# EAGLE design preparedinstruments_0_bechemel_v12_KEYPAD_no_values (EAGLE 9.6.2)

## Sheet 1 of 2
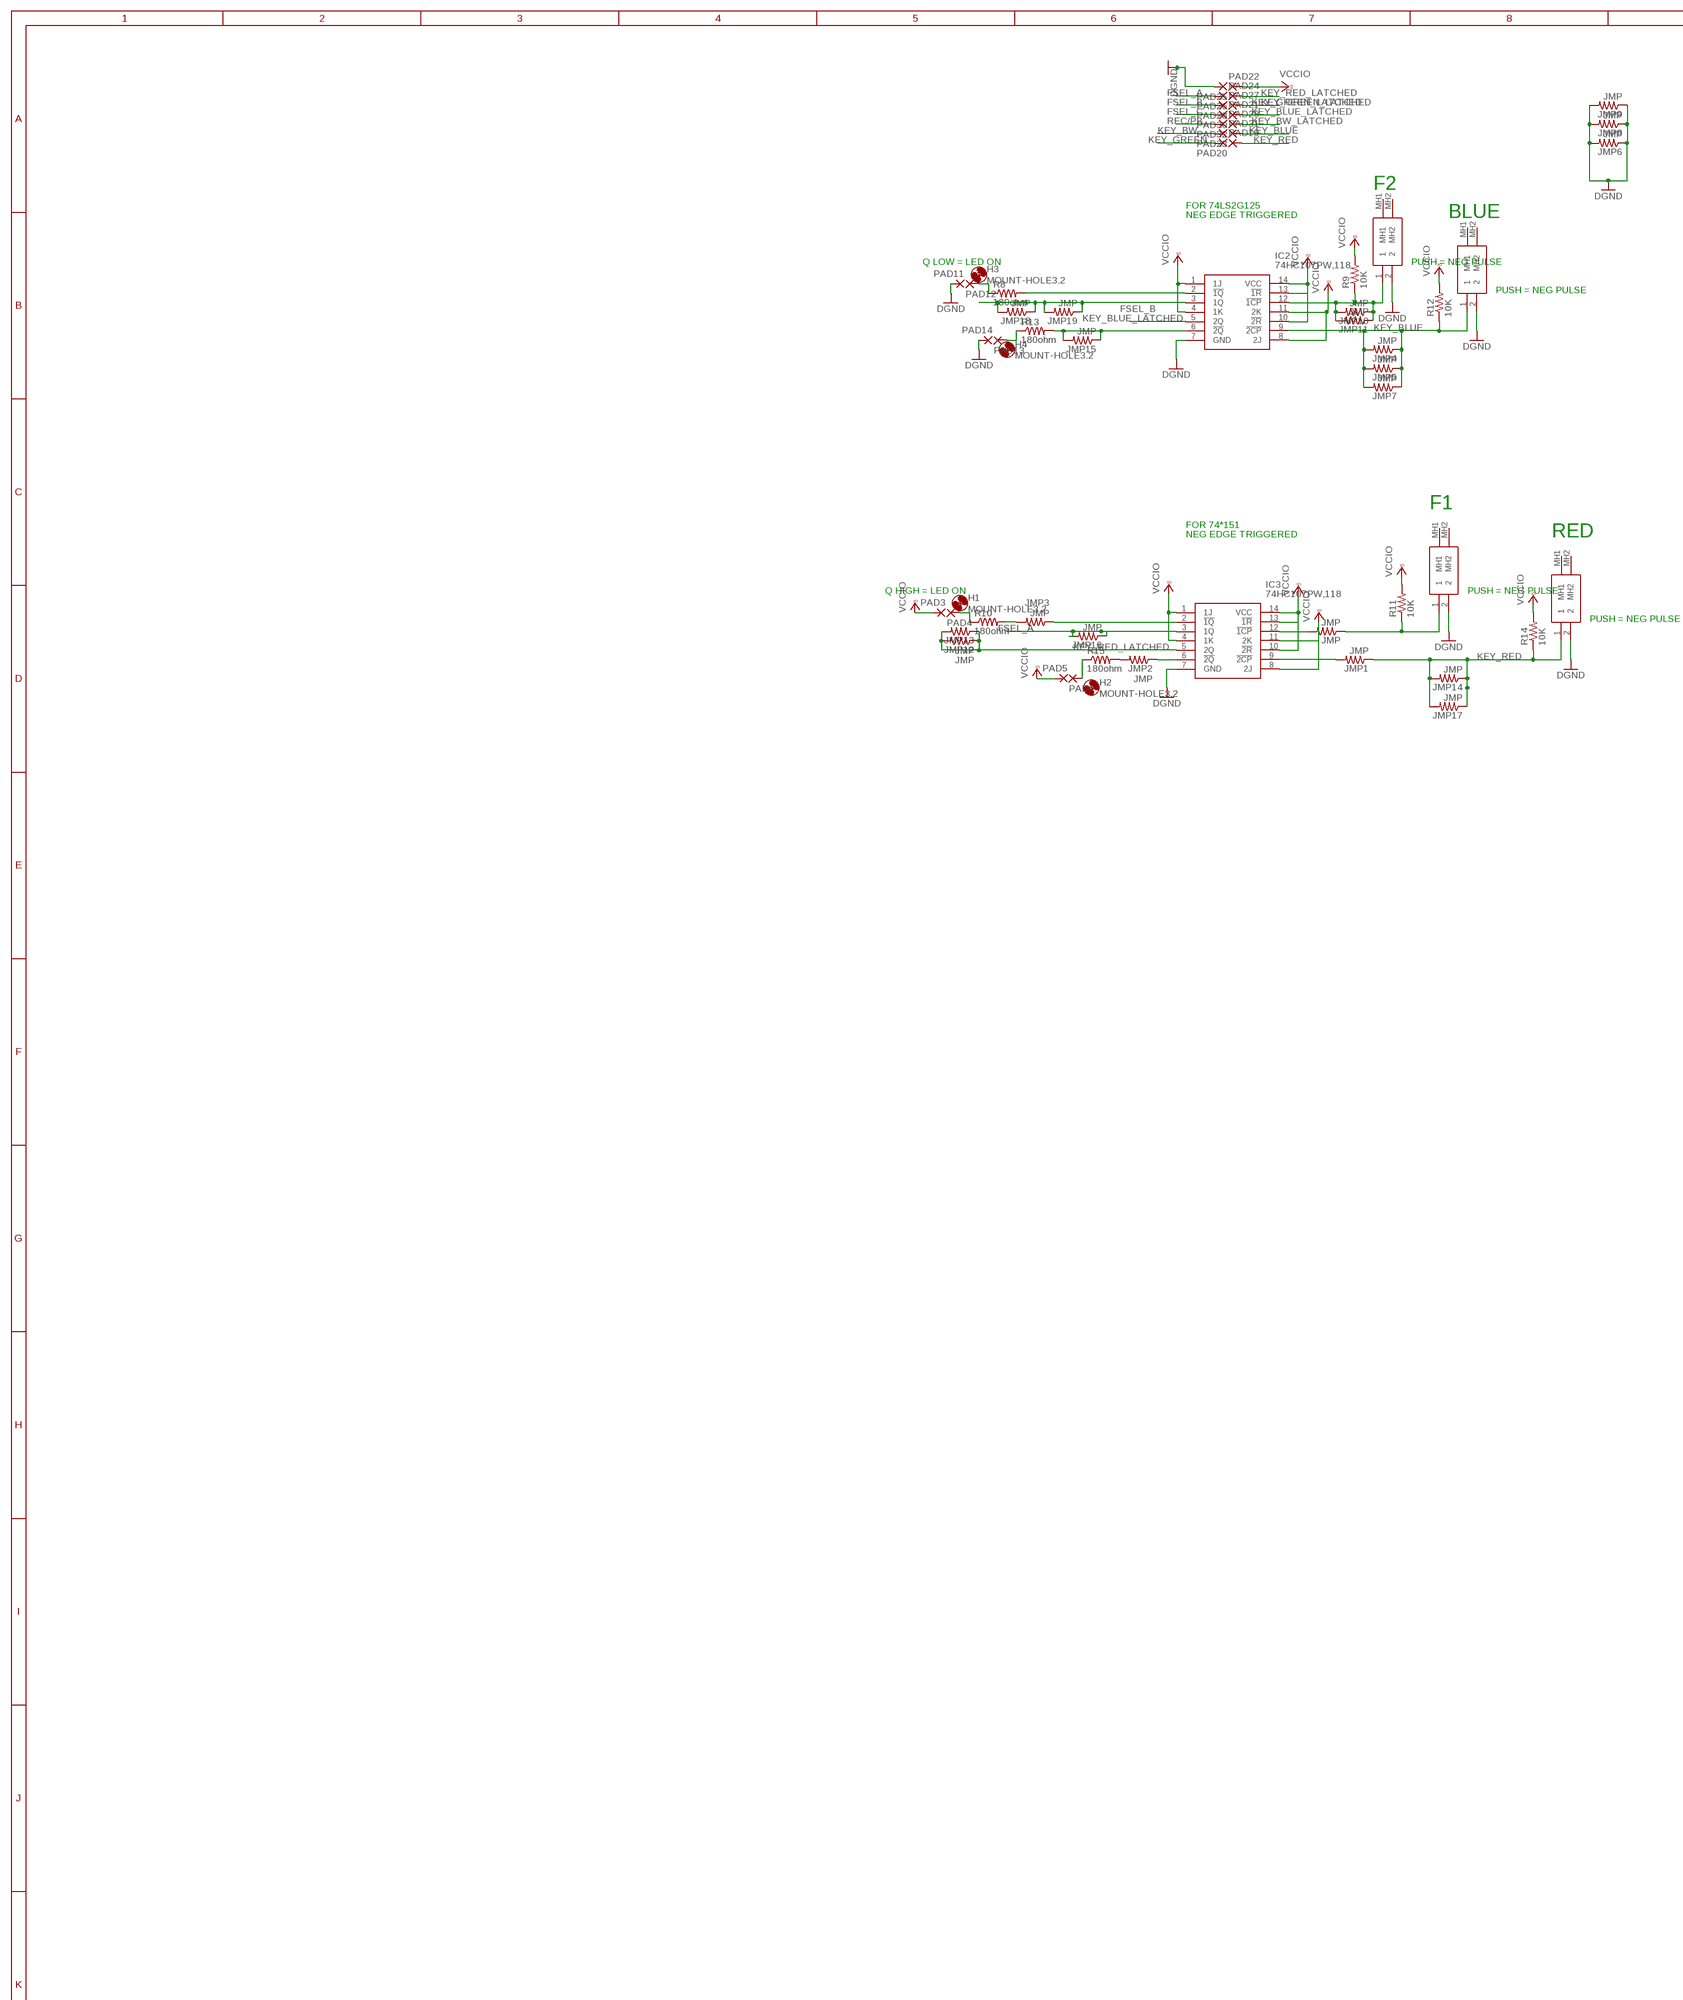
[diagram p0: schematic, sheet 1, part 1 of 3]
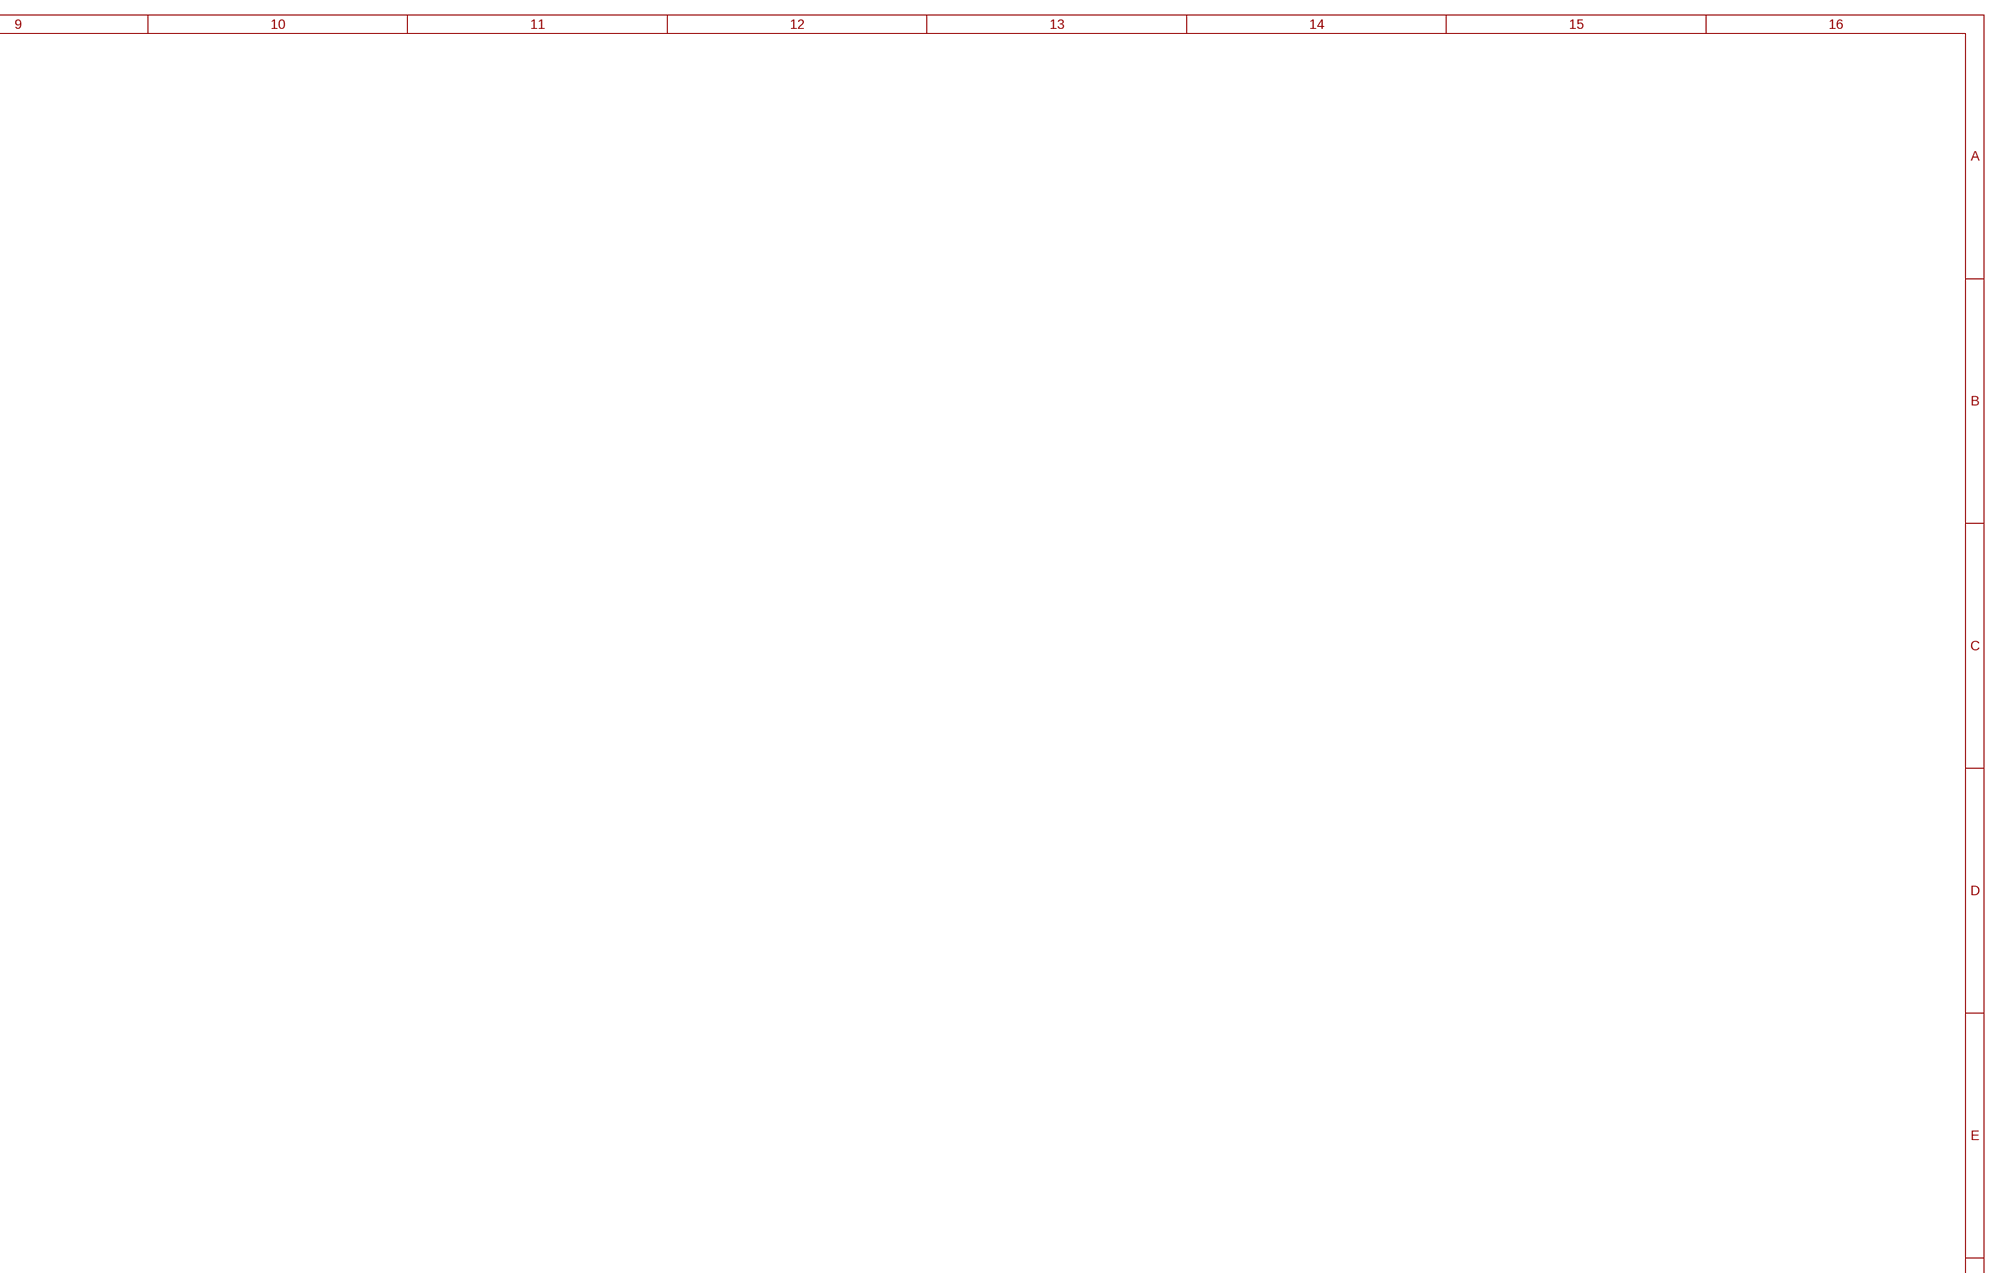
[diagram p1: schematic, sheet 1, part 2 of 3]
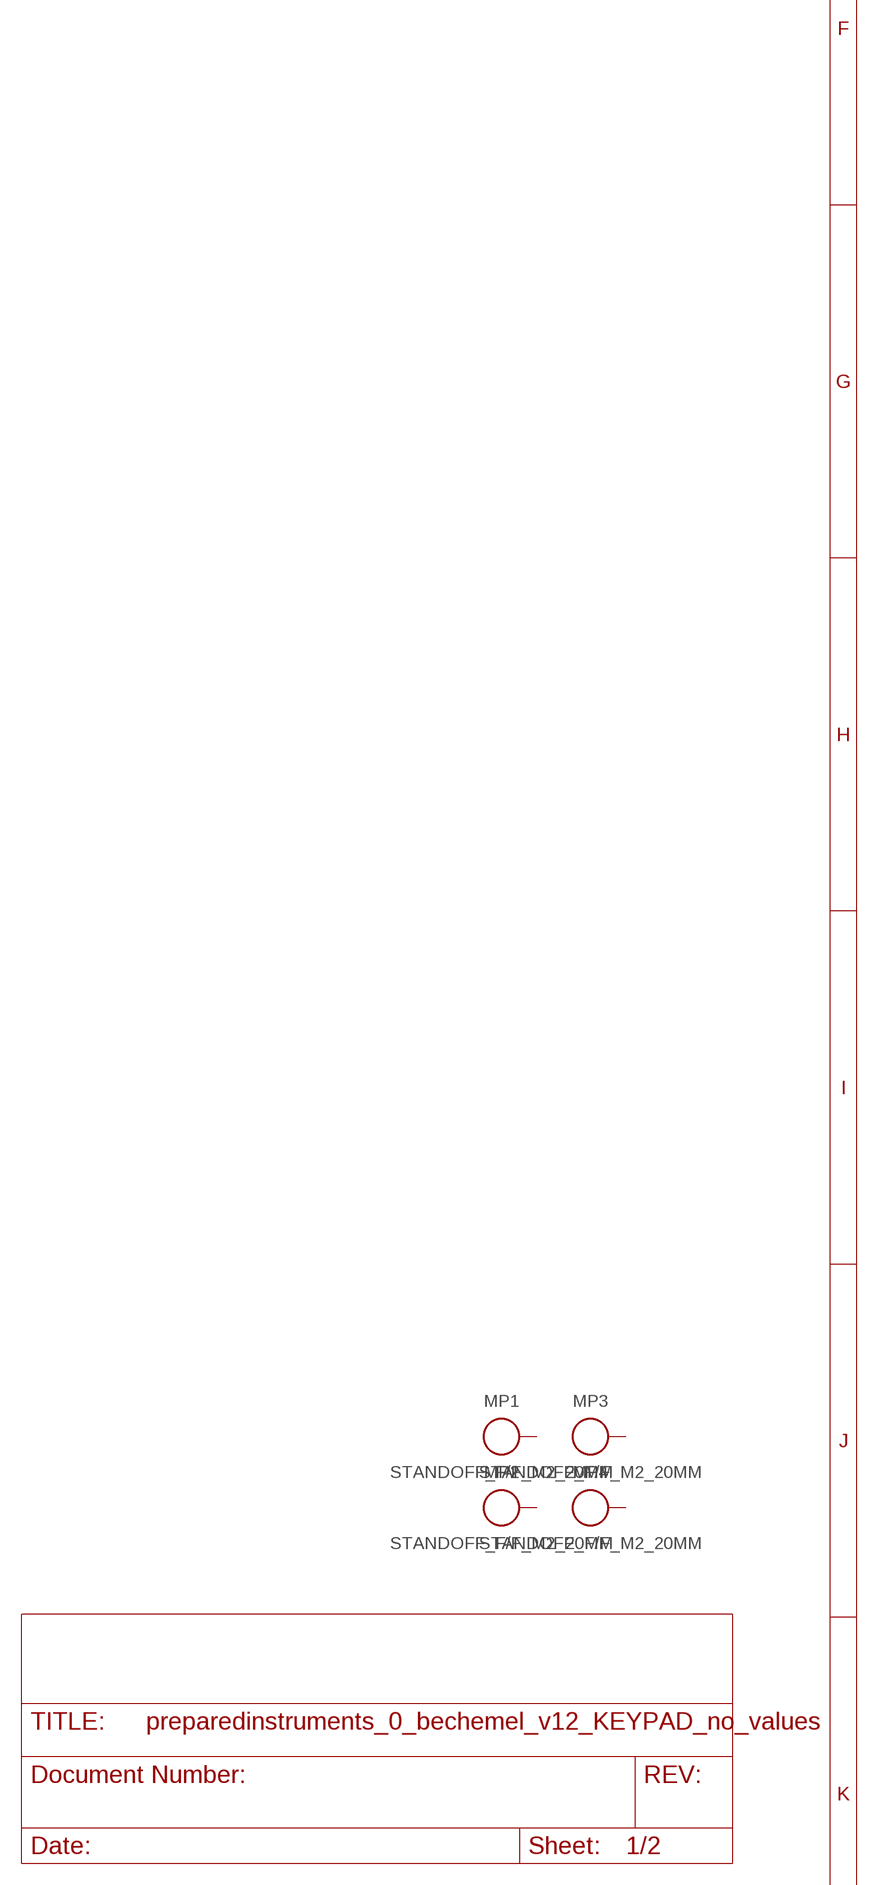
[diagram p2: schematic, sheet 1, part 3 of 3]

### Parts
H1  MOUNT-HOLE3.2  [3,2]
H2  MOUNT-HOLE3.2  [3,2]
H3  MOUNT-HOLE3.2  [3,2]
H4  MOUNT-HOLE3.2  [3,2]
IC2  74HC107PW,118  [SOP65P640X110-14N]
IC3  74HC107PW,118  [SOP65P640X110-14N]
JMP  JMP  R-US_R0805  [R0805]
JMP1  JMP  R-US_R0805  [R0805]
JMP2  JMP  R-US_R0805  [R0805]
JMP3  JMP  R-US_R0805  [R0805]
JMP4  JMP  R-US_R0805  [R0805]
JMP5  JMP  R-US_R0805  [R0805]
JMP6  JMP  R-US_R0805  [R0805]
JMP7  JMP  R-US_R0805  [R0805]
JMP8  JMP  R-US_R0805  [R0805]
JMP9  JMP  R-US_R0805  [R0805]
JMP10  JMP  R-US_R0805  [R0805]
JMP11  JMP  R-US_R0805  [R0805]
JMP12  JMP  R-US_R0805  [R0805]
JMP13  JMP  R-US_R0805  [R0805]
JMP14  JMP  R-US_R0805  [R0805]
JMP15  JMP  R-US_R0805  [R0805]
JMP16  JMP  R-US_R0805  [R0805]
JMP17  JMP  R-US_R0805  [R0805]
JMP18  JMP  R-US_R0805  [R0805]
JMP19  JMP  R-US_R0805  [R0805]
MP1  STANDOFF_F/F_M2_20MM  [STANDOFF_HEX_FEMALE_400X2000_M2X0.4_MTGP600H220]
MP2  STANDOFF_F/F_M2_20MM  [STANDOFF_HEX_FEMALE_400X2000_M2X0.4_MTGP600H220]
MP3  STANDOFF_F/F_M2_20MM  [STANDOFF_HEX_FEMALE_400X2000_M2X0.4_MTGP600H220]
MP4  STANDOFF_F/F_M2_20MM  [STANDOFF_HEX_FEMALE_400X2000_M2X0.4_MTGP600H220]
PAD3  SMD2  [SMD1,27-2,54]
PAD4  SMD2  [SMD1,27-2,54]
PAD5  SMD2  [SMD1,27-2,54]
PAD6  SMD2  [SMD1,27-2,54]
PAD11  SMD2  [SMD1,27-2,54]
PAD12  SMD2  [SMD1,27-2,54]
PAD13  SMD2  [SMD1,27-2,54]
PAD14  SMD2  [SMD1,27-2,54]
PAD19  SMD2  [SMD1,27-2,54]
PAD20  SMD2  [SMD1,27-2,54]
PAD21  SMD2  [SMD1,27-2,54]
PAD22  SMD2  [SMD1,27-2,54]
PAD23  SMD2  [SMD1,27-2,54]
PAD24  SMD2  [SMD1,27-2,54]
PAD25  SMD2  [SMD1,27-2,54]
PAD26  SMD2  [SMD1,27-2,54]
PAD27  SMD2  [SMD1,27-2,54]
PAD28  SMD2  [SMD1,27-2,54]
PAD29  SMD2  [SMD1,27-2,54]
PAD30  SMD2  [SMD1,27-2,54]
PAD31  SMD2  [SMD1,27-2,54]
PAD32  SMD2  [SMD1,27-2,54]
R8  180ohm  R-US_R0805  [R0805]
R9  10K  R-US_R0805  [R0805]
R10  180ohm  R-US_R0805  [R0805]
R11  10K  R-US_R0805  [R0805]
R12  10K  R-US_R0805  [R0805]
R13  180ohm  R-US_R0805  [R0805]
R14  10K  R-US_R0805  [R0805]
R15  180ohm  R-US_R0805  [R0805]
S6  MX1A-11NW  [MX1A11NW]
S7  MX1A-11NW  [MX1A11NW]
S8  MX1A-11NW  [MX1A11NW]
S9  MX1A-11NW  [MX1A11NW]

### Nets
DGND: IC2.7(GND) IC3.7(GND) JMP6.1 JMP6.2 JMP8.1 JMP8.2 JMP9.1 JMP9.2 PAD11.1(P) PAD14.1(P) PAD25.1(P) S6.2 S7.2 S8.2 S9.2 ; also sheet 2
FSEL_A: IC3.3(1Q) JMP16.1 JMP16.2 PAD26.1(P)
FSEL_B: IC2.3(1Q) JMP18.1 JMP18.2 JMP19.1 JMP19.2 PAD28.1(P)
FSEL_C: PAD30.1(P) ; also sheet 2
KEY_BLUE: IC2.9(!2CP) JMP4.1 JMP4.2 JMP5.1 JMP5.2 JMP7.1 JMP7.2 PAD31.1(P) R12.1 S8.1
KEY_BLUE_LATCHED: IC2.5(2Q) PAD21.1(P)
KEY_BW: PAD23.1(P) ; also sheet 2
KEY_BW_LATCHED: PAD29.1(P) ; also sheet 2
KEY_GREEN: PAD20.1(P) ; also sheet 2
KEY_GREEN_LATCHED: PAD27.1(P) ; also sheet 2
KEY_RED: JMP1.1 JMP14.1 JMP14.2 JMP17.1 JMP17.2 PAD19.1(P) R14.1 S9.1
KEY_RED_LATCHED: IC3.5(2Q) JMP12.1 JMP12.2 JMP13.1 JMP13.2 PAD24.1(P)
N$13: PAD12.1(P) R8.1
N$14: IC2.2(!1Q) R8.2
N$16: IC2.12(!1CP) JMP10.1 JMP10.2 JMP11.1 JMP11.2 R9.1 S6.1
N$17: PAD4.1(P) R10.1
N$18: JMP3.2 R10.2
N$20: IC3.12(!1CP) JMP.2
N$22: PAD13.1(P) R13.1
N$23: IC2.6(!2Q) JMP15.1 JMP15.2 R13.2
N$26: PAD6.1(P) R15.1
N$27: JMP2.2 R15.2
N$33: JMP.1 R11.1 S7.1
N$35: IC3.9(!2CP) JMP1.2
N$36: IC3.6(!2Q) JMP2.1
N$37: IC3.2(!1Q) JMP3.1
REC/PB: PAD32.1(P) ; also sheet 2
VCCIO: IC2.1(1J) IC2.4(1K) IC2.8(2J) IC2.10(!2R) IC2.11(2K) IC2.13(!1R) IC2.14(VCC) IC3.1(1J) IC3.4(1K) IC3.8(2J) IC3.10(!2R) IC3.11(2K) IC3.13(!1R) IC3.14(VCC) PAD3.1(P) PAD5.1(P) PAD22.1(P) R9.2 R11.2 R12.2 R14.2 ; also sheet 2
Unconnected: MP1.1 MP2.1 MP3.1 MP4.1 S6.MH1 S6.MH2 S7.MH1 S7.MH2 S8.MH1 S8.MH2 S9.MH1 S9.MH2

### Notes on the sheet
- F2
- FOR 74LS2G125
- NEG EDGE TRIGGERED | BLUE
- Q LOW = LED ON | PUSH = NEG PULSE
- PUSH = NEG PULSE
- F1
- FOR 74*151
- NEG EDGE TRIGGERED | RED
- Q HIGH = LED ON | PUSH = NEG PULSE
- PUSH = NEG PULSE

## Sheet 2 of 2
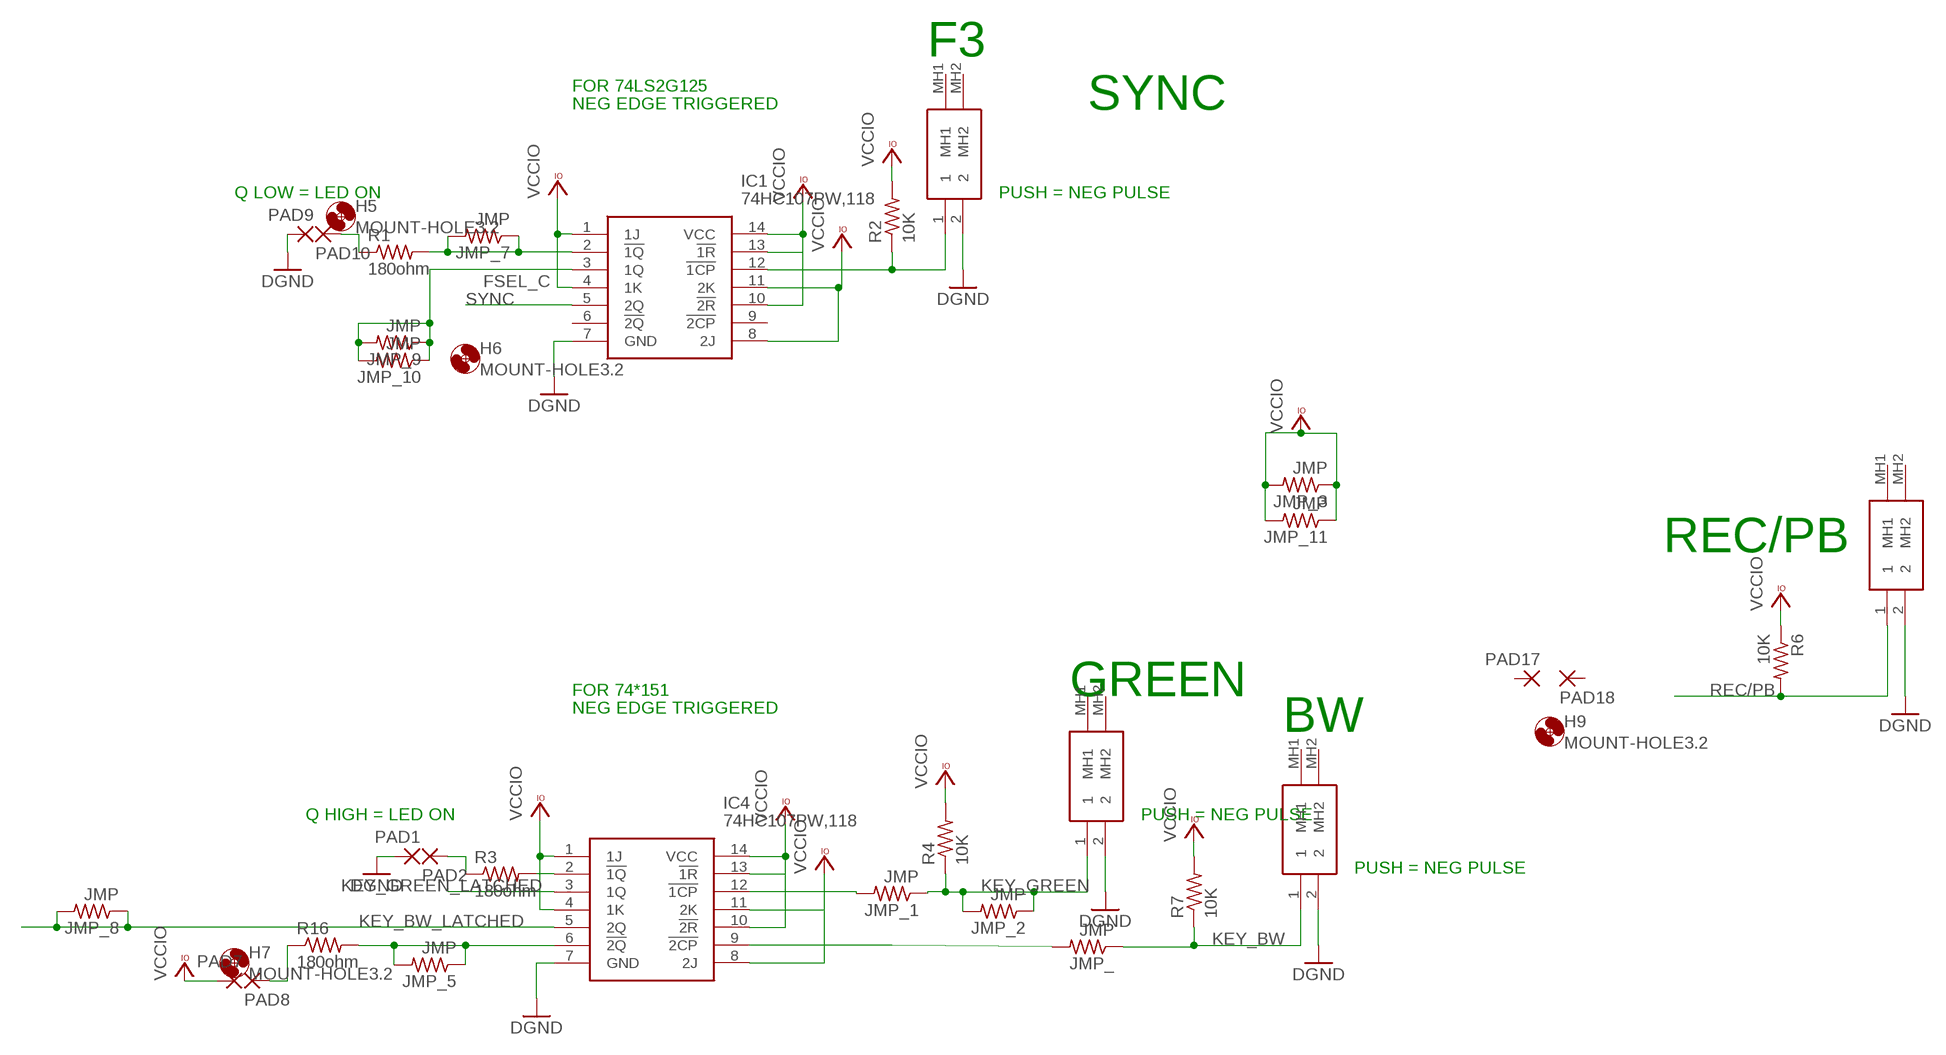
[diagram p3: schematic, sheet 2]

### Parts
H5  MOUNT-HOLE3.2  [3,2]
H6  MOUNT-HOLE3.2  [3,2]
H7  MOUNT-HOLE3.2  [3,2]
H9  MOUNT-HOLE3.2  [3,2]
IC1  74HC107PW,118  [SOP65P640X110-14N]
IC4  74HC107PW,118  [SOP65P640X110-14N]
JMP_  JMP  R-US_R0805  [R0805]
JMP_1  JMP  R-US_R0805  [R0805]
JMP_2  JMP  R-US_R0805  [R0805]
JMP_3  JMP  R-US_R0805  [R0805]
JMP_5  JMP  R-US_R0805  [R0805]
JMP_7  JMP  R-US_R0805  [R0805]
JMP_8  JMP  R-US_R0805  [R0805]
JMP_9  JMP  R-US_R0805  [R0805]
JMP_10  JMP  R-US_R0805  [R0805]
JMP_11  JMP  R-US_R0805  [R0805]
PAD1  SMD2  [SMD1,27-2,54]
PAD2  SMD2  [SMD1,27-2,54]
PAD7  SMD2  [SMD1,27-2,54]
PAD8  SMD2  [SMD1,27-2,54]
PAD9  SMD2  [SMD1,27-2,54]
PAD10  SMD2  [SMD1,27-2,54]
PAD17  SMD2  [SMD1,27-2,54]
PAD18  SMD2  [SMD1,27-2,54]
R1  180ohm  R-US_R0805  [R0805]
R2  10K  R-US_R0805  [R0805]
R3  180ohm  R-US_R0805  [R0805]
R4  10K  R-US_R0805  [R0805]
R6  10K  R-US_R0805  [R0805]
R7  10K  R-US_R0805  [R0805]
R16  180ohm  R-US_R0805  [R0805]
S1  MX1A-11NW  [MX1A11NW]
S2  MX1A-11NW  [MX1A11NW]
S4  MX1A-11NW  [MX1A11NW]
S5  MX1A-11NW  [MX1A11NW]

### Nets
DGND: IC1.7(GND) IC4.7(GND) PAD1.1(P) PAD9.1(P) S1.2 S2.2 S4.2 S5.2 ; also sheet 1
FSEL_C: IC1.3(1Q) JMP_9.1 JMP_9.2 JMP_10.1 JMP_10.2 ; also sheet 1
KEY_BW: JMP_.1 R7.1 S4.1 ; also sheet 1
KEY_BW_LATCHED: IC4.5(2Q) JMP_8.1 JMP_8.2 ; also sheet 1
KEY_GREEN: JMP_1.1 JMP_2.1 JMP_2.2 R4.1 S2.1 ; also sheet 1
KEY_GREEN_LATCHED: IC4.3(1Q) ; also sheet 1
N$1: PAD10.1(P) R1.1
N$2: IC1.2(!1Q) JMP_7.1 JMP_7.2 R1.2
N$4: IC1.12(!1CP) R2.1 S1.1
N$5: PAD2.1(P) R3.1
N$6: IC4.2(!1Q) R3.2
N$30: PAD8.1(P) R16.1
N$31: IC4.6(!2Q) JMP_5.1 JMP_5.2 R16.2
N$34: IC4.9(!2CP) JMP_.2
N$39: IC4.12(!1CP) JMP_1.2
REC/PB: R6.2 S5.1 ; also sheet 1
SYNC: IC1.5(2Q)
VCCIO: IC1.1(1J) IC1.4(1K) IC1.8(2J) IC1.10(!2R) IC1.11(2K) IC1.13(!1R) IC1.14(VCC) IC4.1(1J) IC4.4(1K) IC4.8(2J) IC4.10(!2R) IC4.11(2K) IC4.13(!1R) IC4.14(VCC) JMP_3.1 JMP_3.2 JMP_11.1 JMP_11.2 PAD7.1(P) R2.2 R4.2 R6.1 R7.2 ; also sheet 1
Unconnected: IC1.6(!2Q) IC1.9(!2CP) PAD17.1(P) PAD18.1(P) S1.MH1 S1.MH2 S2.MH1 S2.MH2 S4.MH1 S4.MH2 S5.MH1 S5.MH2

### Notes on the sheet
- F3
- FOR 74LS2G125
- NEG EDGE TRIGGERED | SYNC
- Q LOW = LED ON | PUSH = NEG PULSE
- REC/PB
- FOR 74*151 | GREEN
- NEG EDGE TRIGGERED
- BW
- Q HIGH = LED ON | PUSH = NEG PULSE
- PUSH = NEG PULSE

## Library data of the parts
H1-H7 H9 = holes:MOUNT-HOLE: MOUNTING HOLE with drill center marker
IC1-IC4 = 74HC107PW_118:74HC107PW,118: 74HC(T)107 - Dual JK flip-flop with reset; negative-edge trigger@en-us Source: Datasheet <https://assets.nexperia.com/documents/data-sheet/74HC_HCT107.pdf>; DESCRIPTION: 74HC(T)107 - Dual JK flip-flop with reset; negative-edge trigger@en-us; HEIGHT: 1.1mm; MANUFACTURER_NAME: Nexperia; MANUFACTURER_PART_NUMBER: 74HC107PW,118; MOUSER_PART_NUMBER: 771-HC107PW118; MOUSER_PRICE-STOCK: https://www.mouser.co.uk/ProductDetail/Nexperia/74HC107PW118?qs=P62ublwmbi8k2l1WkAc68Q%3D%3D
JMP JMP1-JMP19 JMP_ JMP_1-JMP_3 JMP_5 JMP_7-JMP_11 R1-R4 R6-R16 = adafruit:R-US_: RESISTOR, American symbol
MP1-MP4 = PCB-Fasteners_Hardware:STANDOFF_F/F: Female-Female Standoff/Spacer with Mounting pad and hole. Essentra : Female Standoff <https://www.essentracomponents.co.in/index.php?option=com_virtuemart&view=productdetails&virtuemart_product_id=14493> The hole and pad sizes may vary based on the application and type of hardware; always verify the Manufacturer specification or Global Standards.; CATEGORY: Standoff/Spacer; SUB-CATEGORY: Female-Female
PAD1-PAD14 PAD17-PAD32 = wirepad:SMD2: SMD PAD
S1 S2 S4-S9 = MX1A-11NW:MX1A-11NW: CHERRY - MX1A-11NW - Tactile Switch, MX Series, Top Actuated, Surface Mount, Plunger for Cap, 59.5 gf, 10mA at 12VDC Source: Datasheet <https://media.digikey.com/pdf/Data Sheets/Cherry PDFs/MX Series.pdf>; DESCRIPTION: CHERRY - MX1A-11NW - Tactile Switch, MX Series, Top Actuated, Surface Mount, Plunger for Cap, 59.5 gf, 10mA at 12VDC; HEIGHT: 15.2mm; MANUFACTURER_NAME: Cherry; MANUFACTURER_PART_NUMBER: MX1A-11NW; MOUSER_PART_NUMBER: 540-MX1A-11NW; MOUSER_PRICE-STOCK: https://www.mouser.co.uk/ProductDetail/CHERRY/MX1A-11NW?qs=5iusCjFLgR7487Rvpe7dvw%3D%3D

## Board
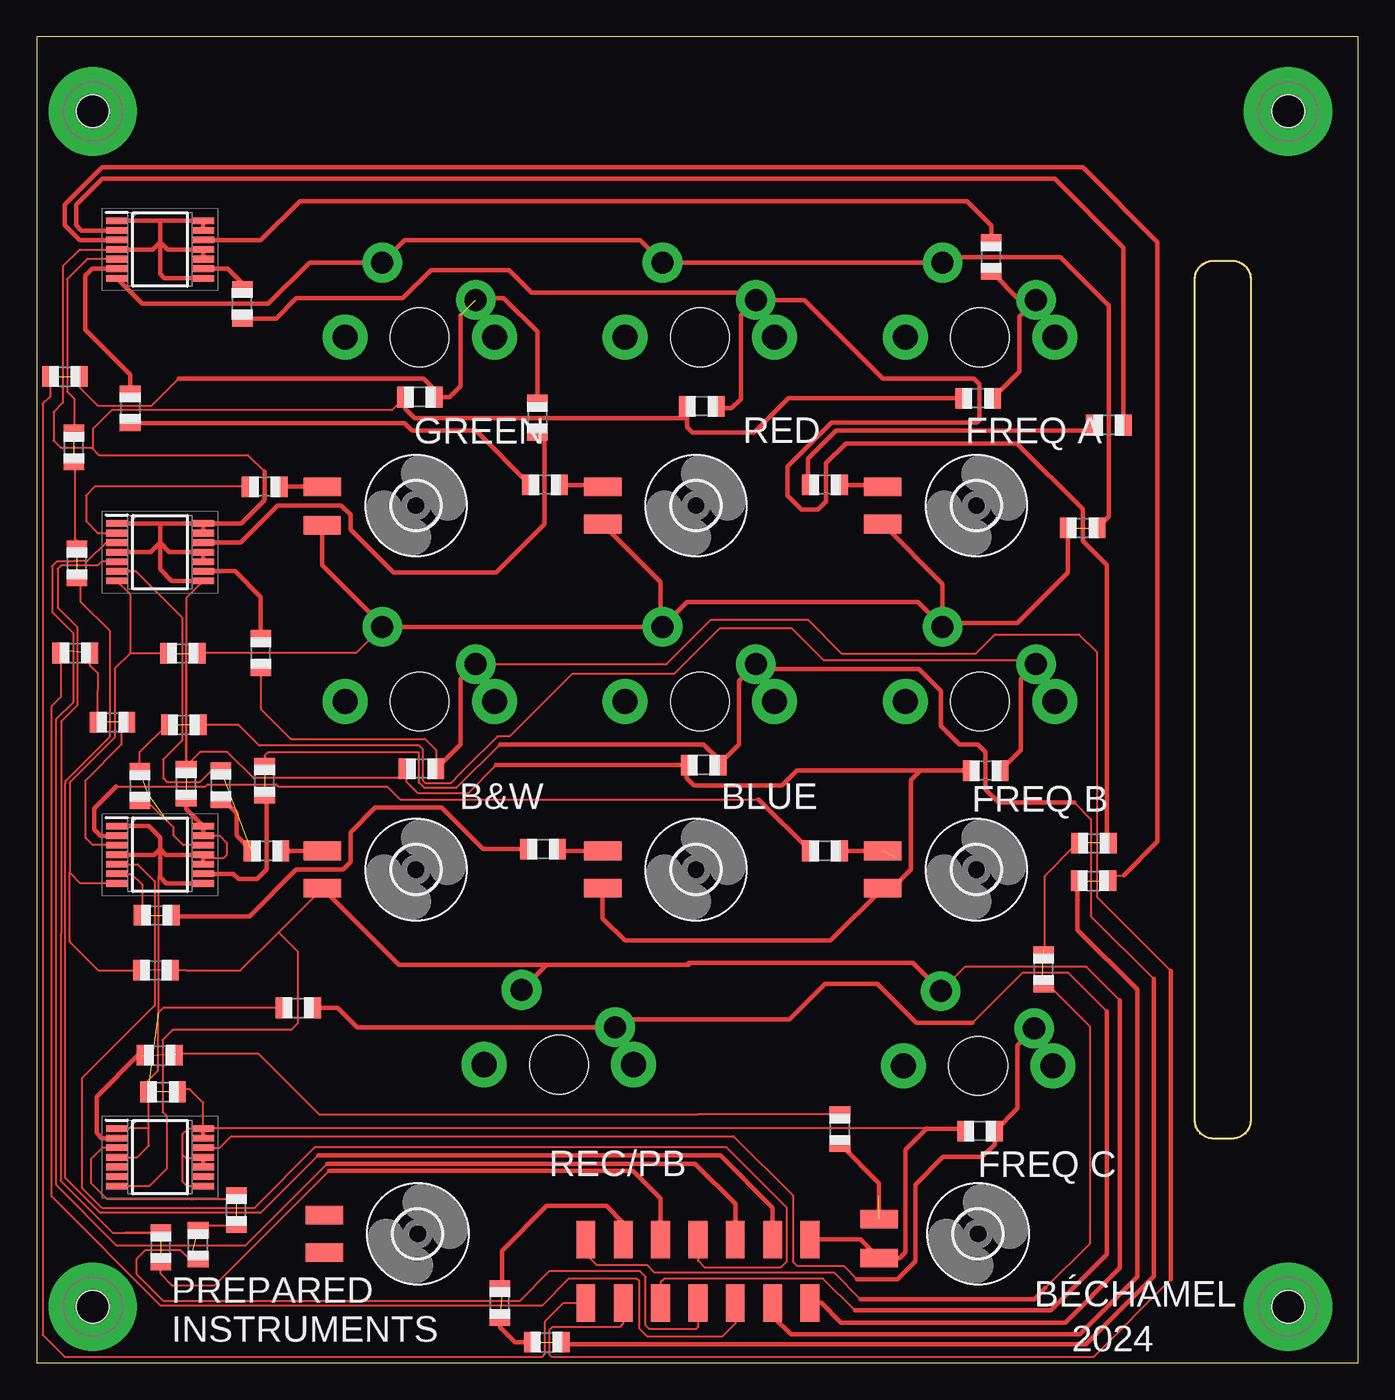
[diagram p4: board, top side]
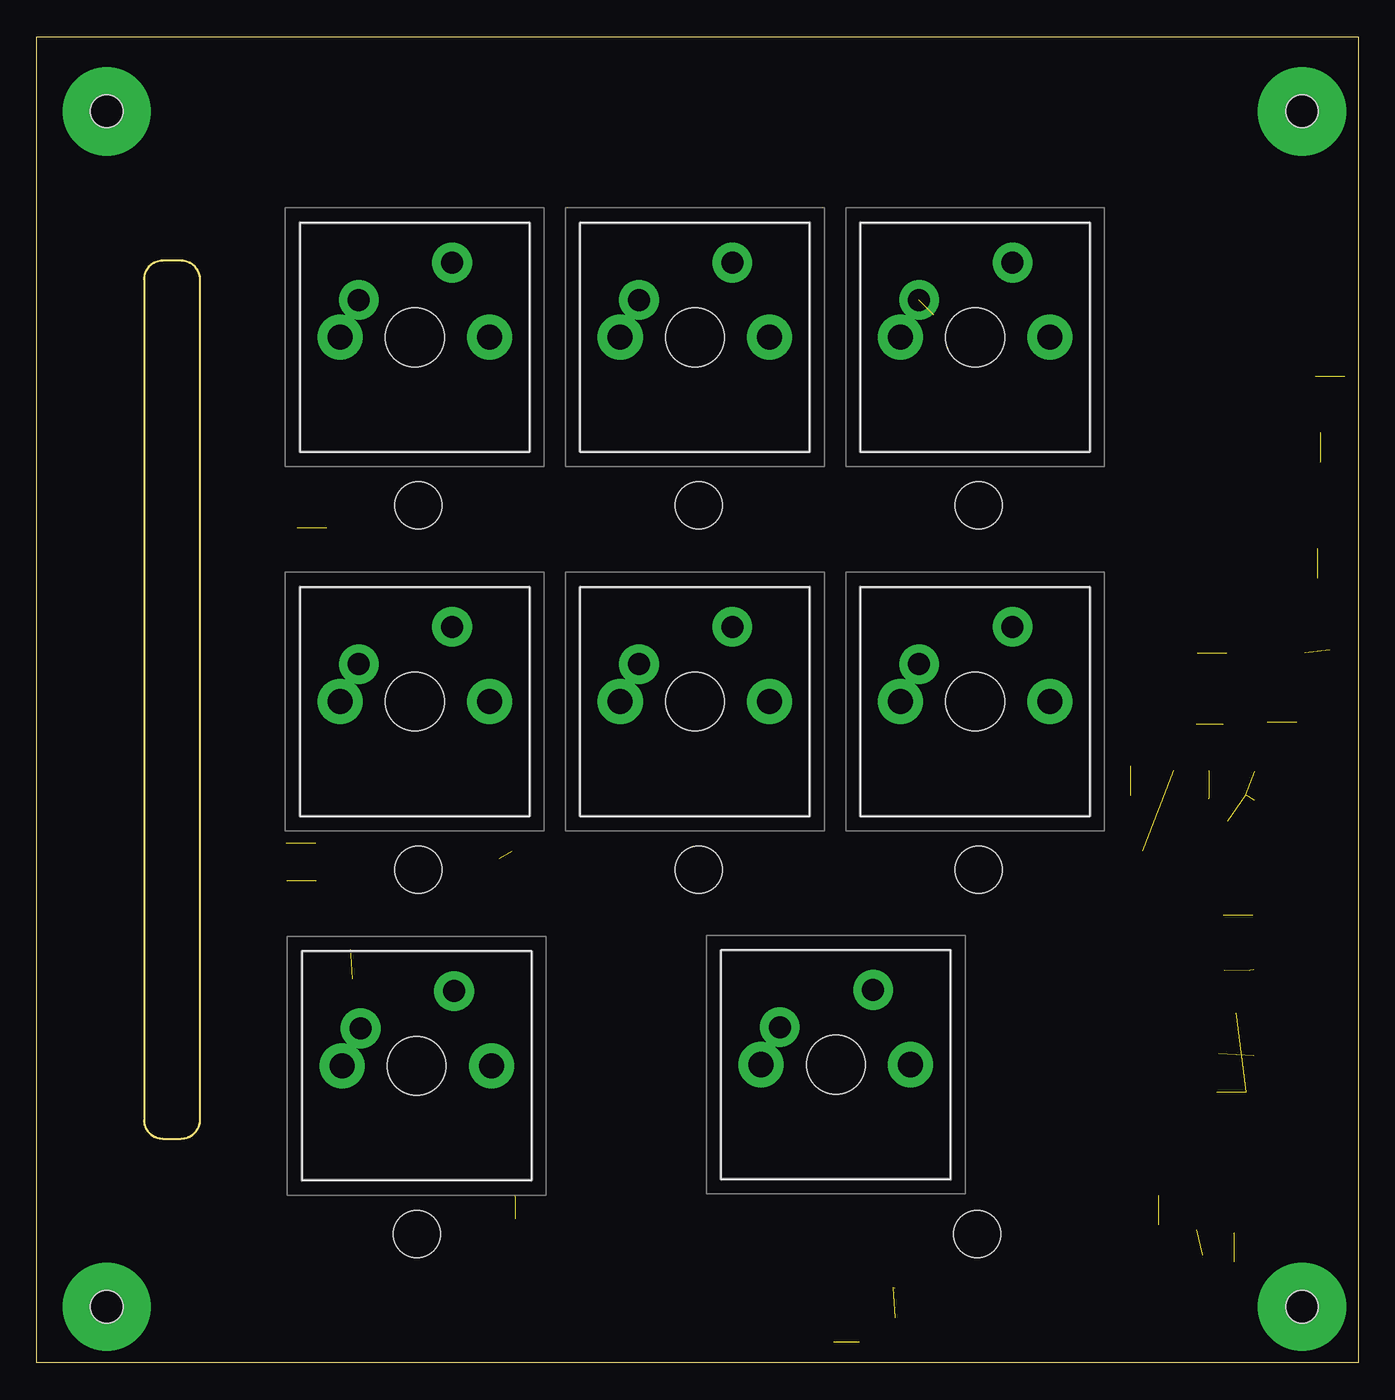
[diagram p5: board, bottom side, seen from below]

Size 89.84 x 90.16 mm. Coordinates in mm from the lower left corner, seen from the top.
Outline: 0,0 89.84,0 89.84,90.16 0,90.16 0,0
Outline: 82.55,73.66 82.55,16.51 arc-90 81.28,15.24 80.01,15.24 arc-90 78.74,16.51 78.74,73.66 arc-90 80.01,74.93 81.28,74.93 arc-90 82.55,73.66
Copper layers (1*16): Top 0.035mm / dielectric 1.6mm / Bottom 0.035mm
Design rules "jlcpcb-2layers": minimum track width 5mil, minimum drill 0.3mm, track to track 5mil, track to pad 5mil, pad to pad 5mil, via to via 5mil, smd to smd 5mil, copper to edge 0.2mm, drill to drill 6mil, minimum pad ring 10mil, minimum via ring 3mil, stop-mask expansion 4mil, vias tented up to drill 0mil, thermal gap 10mil

### Footprints (pad centres in the part's own frame; a part is rotated, then mirrored left to right if it is on the bottom)
3,2 = hole 3.2: 0,0
SOP65P640X110-14N = smd 1.475 x 0.45: 1 -2.938,1.95; 2 -2.938,1.3; 3 -2.938,0.65; 4 -2.938,0; 5 -2.938,-0.65; 6 -2.938,-1.3; 7 -2.938,-1.95; 8 2.938,-1.95; 9 2.938,-1.3; 10 2.938,-0.65; 11 2.938,0; 12 2.938,0.65; 13 2.938,1.3; 14 2.938,1.95
R0805 = smd 1.1 x 1.4: 1 -1,0; 2 1,0
STANDOFF_HEX_FEMALE_400X2000_M2X0.4_MTGP600H220 = drill 2.2 pad 6: 1 0,0 | hole 2.2: 0,0
SMD1,27-2,54 = smd 1.27 x 2.54: 1 0,0
MX1A11NW = drill 1.499 pad 2.248: 1 0,0; 2 6.35,2.54 | drill 1.702 pad 2.553: MH1 -1.27,-2.54; MH2 8.89,-2.54 | hole 3.988: 3.81,-2.54

### Placement (x,y rotation side)
H1  63.88,33.53 0 top
H2  44.83,33.53 0 top
H3  44.83,58.29 0 top
H4  63.88,58.29 0 top
H5  25.78,33.53 0 top
H6  25.78,58.29 0 top
H7  64.01,8.76 0 top
H9  25.91,8.76 0 top
IC1  8.38,13.97 0 top
IC2  8.38,34.54 0 top
IC3  8.38,75.69 0 top
IC4  8.38,55.12 0 top
JMP  64.9,75.18 90 top
JMP1  13.97,72.01 90 top
JMP2  6.35,64.9 270 top
JMP3  72.9,63.75 180 top
JMP4  31.5,4.06 90 top
JMP5  34.67,1.4 0 top
JMP6  71.12,56.77 0 top
JMP7  15.49,39.57 90 top
JMP8  9.93,48.23 0 top
JMP9  8.1,26.7 0 top
JMP10  7.01,39.22 90 top
JMP11  10.01,43.38 0 top
JMP12  2.54,62.23 90 top
JMP13  2.74,54.36 90 top
JMP14  71.88,35.33 0 top
JMP15  8.15,30.43 0 top
JMP16  71.86,32.77 0 top
JMP17  68.45,26.75 90 top
JMP18  5.16,43.56 0 top
JMP19  2.62,48.26 0 top
JMP_  15.24,48.26 90 top
JMP_1  34.04,64.26 270 top
JMP_2  1.91,67.06 0 top
JMP_3  10.16,39.37 90 top
JMP_5  12.52,39.27 90 top
JMP_7  8.36,20.9 0 top
JMP_8  8.43,7.85 90 top
JMP_9  10.97,8.03 90 top
JMP_10  13.56,10.39 90 top
JMP_11  8.59,18.41 0 top
MP1  85.09,3.81 0 top
MP2  85.09,85.09 0 top
MP3  3.81,3.81 0 top
MP4  3.81,85.09 0 top
PAD1  19.41,56.95 90 top
PAD2  19.43,59.56 90 top
PAD3  38.48,32.26 90 top
PAD4  57.53,59.56 90 top
PAD5  57.53,32.26 90 top
PAD6  38.48,59.56 90 top
PAD7  57.28,7.11 90 top
PAD8  19.43,34.8 90 top
PAD9  19.43,32.26 90 top
PAD10  57.28,9.78 90 top
PAD11  38.48,57.02 90 top
PAD12  57.53,34.8 90 top
PAD13  38.48,34.8 90 top
PAD14  57.53,57.02 90 top
PAD17  19.56,7.49 90 top
PAD18  19.56,10.03 90 top
PAD19  37.34,8.38 180 top
PAD20  37.34,4.06 180 top
PAD21  44.96,8.38 180 top
PAD22  52.58,8.38 180 top
PAD23  39.88,4.06 180 top
PAD24  50.04,8.38 180 top
PAD25  52.58,4.06 180 top
PAD26  50.04,4.06 180 top
PAD27  47.5,8.38 180 top
PAD28  47.5,4.06 180 top
PAD29  42.42,8.38 180 top
PAD30  44.96,4.06 180 top
PAD31  39.88,8.38 180 top
PAD32  42.42,4.06 180 top
R1  54.61,15.88 90 top
R2  64.14,15.75 180 top
R3  15.49,59.56 180 top
R4  26.04,65.66 180 top
R6  17.78,24.13 0 top
R7  26.16,40.39 180 top
R8  53.59,34.8 180 top
R9  64.52,40.26 180 top
R10  53.59,59.69 180 top
R11  64.01,65.58 180 top
R12  45.34,40.64 180 top
R13  34.42,34.92 180 top
R14  45.21,65.02 180 top
R15  34.54,59.69 180 top
R16  15.62,34.8 180 top
S1  67.82,22.73 0 bottom
S2  29.84,72.26 0 bottom
S4  29.84,47.5 0 bottom
S5  39.32,22.81 0 bottom
S6  67.94,47.5 0 bottom
S7  67.94,72.26 0 bottom
S8  48.9,47.5 0 bottom
S9  48.9,72.26 0 bottom

### Tracks (layer width: path | path; a pad name or v marks a point on that pad's centre or on a via)
DGND  (4 unrouted)
  Top 0.152: S1.2 63.12,26.92 71.37,26.92 73.66,24.64 | IC2.7 2.97,32.59 2.23,33.33 | 2.26,28.68 2.23,28.7 | 2.23,28.7 2.23,28.63 4.19,26.67 7.37,26.67 | 2.23,28.7 2.23,33.33 | S4.2 21.72,48.26 11.43,48.26 11.4,48.23 JMP8.2 | PAD9.1 16.45,29.27 | 16.45,29.27 13.84,26.67 10.16,26.67 10.13,26.7 JMP9.2 | 16.45,29.27 17.75,27.96 17.75,23.09 17.3,22.63 9.25,22.63 8.56,21.95 8.56,19.05 8.56,18.95 8.56,17.04 8.87,16.74 8.87,13.21 7.68,12.02 IC1.7 | JMP8.1 6.35,48.23 | 6.35,48.23 5.31,47.19 5.31,42.52 2.23,39.45 2.23,33.33 | IC4.7 6.35,52.26 6.35,48.23
  Top 0.305: 42.42,50.04 S4.2 23.5,50.16 19.41,54.25 PAD1.1 | 42.42,50.04 S8.2 44.22,51.71 59.92,51.71 S6.2 61.59,50.29 | 44.45,27.18 59.56,27.18 S1.2 | 44.45,27.18 44.32,27.18 | PAD11.1 42.42,53.09 42.42,50.04 | PAD14.1 61.59,52.96 61.59,50.29 | 61.59,50.29 66.67,50.29 70.12,53.74 JMP6.1 | PAD9.1 24.57,27.11 24.64,27.05 35.56,27.05 | 35.56,27.05 40.64,27.05 44.32,27.05 44.45,27.18 | IC3.7 7.18,72.01 15.75,72.01 18.54,74.8 S2.2 25.02,76.33 41.02,76.33 S9.2 S7.2 61.98,75.18 69.6,75.18 72.9,71.88 72.9,57.55 JMP6.2 | PAD25.1 53.34,4.06 54.69,2.72 69.93,2.72 73.66,6.45 73.66,24.64 | S5.2 34.67,27.05 35.56,27.05
FSEL_A  (1 unrouted)
  Top 0.152: JMP16.2 73.24,33.15 73.91,33.15 | 70.8,31.43 70.8,32.71 70.85,32.76 JMP16.1
  Top 0.305: PAD26.1 50.04,3.17 51.28,1.93 70.92,1.93 74.83,5.84 74.83,25.38 70.76,29.44 70.76,32.84 70.85,32.76 | 70.8,31.43 70.79,31.45 | IC3.3 2.91,76.34 1.91,77.34 1.91,78.74 4.45,81.28 71.12,81.28 76.2,76.2 76.2,35.43 73.91,33.15
FSEL_B  (2 unrouted)
  Top 0.152: IC2.3 3.81,35.19 3.33,35.68 3.33,39.6 5.79,42.06 5.79,43.56 JMP18.2 | PAD28.1 47.5,2.67 46.61,1.78 41.52,1.78 40.97,2.32 40.97,5.53 40.78,5.71 36.17,5.71 34.34,3.89 8.43,3.89 1.02,11.3 1.02,44.65 1.62,45.25 JMP19.1 1.62,48.17 | JMP18.1 4.16,45.72 4.16,46.88 | 4.16,46.88 4.16,46.9 3.63,47.42 | 1.62,48.17 1.91,48.46 | 1.62,48.17 1.49,48.04 | 4.16,46.88 3.62,47.42 JMP19.2
FSEL_C  (2 unrouted)
  Top 0.152: PAD30.1 44.96,2.41 44.83,2.29 41.66,2.29 41.4,2.54 41.4,5.84 41.02,6.22 34.85,6.22 32.82,4.19 8.64,4.19 7.68,5.14 6.81,6.02 6.81,7.06 7.42,7.67 9.75,7.67 10.4,7.03 JMP_9.1 11.03,7.09 11.23,7.09 10.77,7.09 10.54,7.32 | IC1.3 4.46,14.62 3.68,13.84 3.68,12.22 4.22,11.68 | 10.57,11.1 10.52,11.15 10.16,11.15 | 4.06,11.84 4.22,11.68 | 4.22,11.68 4.75,11.15 10.16,11.15 | 10.16,11.15 13.33,11.15 JMP_10.2 | JMP_10.1 13.52,9.34 11.29,9.34 JMP_9.2
KEY_BLUE  (5 unrouted)
  Top 0.152: 70.54,38.1 71.68,36.96 71.68,30.35 75.95,26.09 | 31.5,42.04 28.52,39.06 26.36,39.06 25.98,39.45 25.98,41.45 25.96,41.48 15.7,41.48 15.49,41.27 JMP7.2
  Top 0.305: 70.54,38.1 65.41,38.1 64.52,38.99 64.52,41.53 64.01,42.04 62.74,42.04 61.47,43.31 61.47,45.67 59.97,47.17 49.23,47.17 S8.1 47.75,46.35 47.75,42.05 R12.1 46.34,41.04 45.34,42.04 31.5,42.04 | 75.95,26.09 75.95,5.87 71.35,1.27 35.69,1.27 35.69,1.38 JMP5.2 | PAD31.1 39.88,9.53 38.73,10.67 34.67,10.67 31.62,7.62 31.62,5.08 | JMP4.1 31.5,2.41 32.51,1.4 33.02,1.4 | 33.02,1.4 33.91,1.4 | JMP5.1 33.02,1.4 | IC2.9 13.37,33.24 13.72,32.89 14.99,32.89 15.62,33.53 15.62,38.61 15.49,38.73
KEY_BLUE_LATCHED
  Top 0.152: IC2.5 6.87,33.89 8.03,32.74 8.03,24.28 3.11,19.36 3.11,11.87 4.46,10.52 14.78,10.52 18.9,14.63 41.02,14.63 46.91,14.63 51,10.54 51,6.91 50.6,6.5 45.41,6.5 44.96,6.96 PAD21.1
  Top 0.305: PAD21.1 44.96,8.76
KEY_BW
  Top 0.152: JMP_.1 15.24,44.45 17.27,42.42 26.4,42.42 27.16,41.66 R7.1 | S4.1 42.82,47.5 45.85,50.52 52.43,50.52 54.71,48.23 63.86,48.23 65.15,49.53 70.87,49.53 72.08,48.31 72.08,31.67 77.11,26.64 | 77.11,5.66 71.83,0.38 35.05,0.38 34.85,0.58 34.85,2.21 35.05,2.41 39.62,2.41 39.88,2.67 PAD23.1
  Top 0.305: S4.1 28.83,46.48 28.83,42.05 R7.1 | 77.11,26.64 77.11,5.66 | PAD23.1 39.88,3.81
KEY_BW_LATCHED  (1 unrouted)
  Top 0.152: IC4.5 4.4,54.47 4.15,54.21 1.66,54.21 1.42,53.98 1.42,51.33 2.74,50.01 2.74,44.68 1.65,43.59 1.65,29.15 1.63,29.12 1.63,12.37 5.15,8.85 JMP_8.2 6,8.85 | 19.86,13.06 12.06,5.25 9.22,5.25 8.43,6.04 JMP_8.1
  Top 0.305: PAD29.1 42.42,11.18 40.54,13.06 19.86,13.06
KEY_GREEN  (2 unrouted)
  Top 0.152: PAD20.1 35.81,4.06 34.54,2.79 34.54,0.61 34.34,0.4 1.89,0.4 0.4,1.89 0.4,65.2 0.91,65.71 JMP_2.1 | 9.65,66.93 7.77,65.05 4.17,65.05 2.9,66.31 JMP_2.2
  Top 0.305: 28.83,71.25 28.83,66.42 28.07,65.66 R4.1 27.04,66.18 26.29,66.93 9.65,66.93 | S2.1 29.97,72.39 31.75,72.39 34.04,70.1 JMP_1.1
KEY_GREEN_LATCHED
  Top 0.152: IC4.3 4.71,55.77 3.44,54.5 2.54,54.5 2.54,54.49 1.37,54.49 1.04,54.17 1.04,51.04 2.46,49.62 2.46,44.91 1.29,43.74 1.29,12.12 5.41,8 14.2,8 19.74,13.54
  Top 0.305: PAD27.1 47.5,10.79 44.76,13.54 19.74,13.54
KEY_RED  (3 unrouted)
  Top 0.152: 49.53,6.15 41.99,6.15 41.48,6.66 38.05,6.66 37.34,7.37 | 49.53,6.15 49.73,6.15 | 51.52,6.15 52.07,6.15 | 52.07,6.15 54.19,6.15 56.02,4.32 | JMP14.1 70.58,35.03 70.47,35.03 68.5,33.07 68.5,28.09 | 68.58,5.08 71.63,8.13 71.63,22.84 68.82,25.64 | 68.82,25.64 68.38,26.09 | JMP14.2 72.77,35.44 72.77,35.56 | 68.82,25.64 68.72,25.75 JMP17.1 | 49.53,6.15 52.07,6.15
  Top 0.305: S9.1 48.39,72.77 33.66,72.77 32.13,74.3 26.8,74.3 24.89,72.39 17.65,72.39 16.27,71.01 JMP1.1 | S9.1 47.88,71.25 47.88,65.53 47.24,64.9 46.34,64.9 R14.1 | PAD19.1 37.34,7.37 | S9.1 52.2,72.26 57.53,66.93 63.71,66.93 64.09,66.55 64.09,64.08 63.94,63.93 54.05,63.93 51.05,60.94 51.05,58.98 52,58.02 53.13,58.02 53.68,58.57 53.68,61.18 55.01,62.51 66.64,62.51 71.12,58.03 71.12,55.88 72.77,54.23 72.77,35.56 | 56.02,4.32 67.82,4.32 68.58,5.08
KEY_RED_LATCHED  (2 unrouted)
  Top 0.152: 19.13,14.1 15.21,10.19 4.32,10.19 1.93,12.57 1.93,39.37 1.96,39.4 1.96,39.56 4.98,42.59 4.98,49.76 3,51.74 3,53.37 2.75,53.37 JMP13.1 | IC3.5 3.41,75.04 2.06,73.69 2.06,66.04 2.54,65.56 JMP12.2 | JMP12.1 2.56,61.2 2.56,56.03 2.74,55.85 JMP13.2
  Top 0.305: 50.04,7.49 PAD24.1 50.04,10.54 46.48,14.1 19.13,14.1
N$1  (1 unrouted)
  Top 0.305: R1.1 57.28,12.21 PAD10.1 | 57.28,11.36
N$2  (1 unrouted)
  Top 0.152: JMP_7.2 9.46,21.01 15.09,21.01 19.24,16.86 44.97,16.86 44.95,16.88 R1.2 | JMP_7.1 7.33,20.88
  Top 0.305: IC1.2 4.42,15.27 4.06,15.62 4.06,18.09 6.93,20.96 | 7.33,20.88 7.09,20.88
N$4
  Top 0.152: IC1.12 12.44,14.62 13.22,15.41 47.38,15.41 51.41,11.38 51.41,6.87 51.7,6.58 54.88,6.58 55.76,5.69
  Top 0.305: S1.1 66.67,21.59 66.67,17.29 R2.1 65.14,14.86 64.27,13.99 61.63,13.99 59.74,12.11 59.74,6.89 58.54,5.69 55.76,5.69
N$5
  Top 0.305: PAD2.1 R3.1
N$6
  Top 0.152: R3.2 3.94,59.56 3.35,58.98 3.35,57.23 4.16,56.42 IC4.2
N$13  (1 unrouted)
  Top 0.305: R8.1 57.91,34.8 58.42,34.29
N$14
  Top 0.152: 49.09,38.3 24.69,38.3 23.82,39.17 16.44,39.17 16.28,39.33 11.64,39.33 11.48,39.17 5.38,39.17
  Top 0.305: 49.09,38.3 R8.2 | 3.91,37.69 3.91,36.25 4.34,35.81 5.41,35.81 IC2.2 | 4.04,37.82 3.91,37.69 | 3.91,37.69 5.38,39.17
N$16  (4 unrouted)
  Top 0.152: S6.1 67.69,47.75 53.52,47.75 51.33,49.94 49.53,49.94 | 49.53,49.94 49.07,49.94 | 49.53,49.94 46.43,49.94 43.33,46.84 36.4,46.84 32.16,42.6 31.32,42.6 29.23,40.51 28.83,40.11 | IC2.12 9.94,35.19 9.3,35.84 9.3,36.4 7.62,38.08 7.62,38.1 7.62,38.61 | 28.83,40.11 28.83,40.08 | 28.83,40.11 28.12,39.4 26.42,39.4 26.26,39.56 26.26,41.71 26.01,41.96 15.14,41.96 13.69,43.41 10.95,43.41 10.97,43.38 JMP11.2 | JMP10.2 7.01,41.53 8.89,43.41 | 8.89,43.41 9.17,43.41 | JMP11.1 8.91,43.38 8.89,43.41 | 8.87,36.83
  Top 0.305: S6.1 66.93,46.48 66.93,41.67 R9.1
N$17
  Top 0.305: R10.1 57.4,59.69 PAD4.1
N$18
  Top 0.305: JMP3.2 71.52,63.37 54.36,63.37 52.45,61.47 52.45,59.83 R10.2
N$20
  Top 0.305: JMP.2 64.9,77.33 63.23,78.99 17.91,78.99 15.24,76.33 11.34,76.33 IC3.12
N$22
  Top 0.305: R13.1 35.54,34.8 PAD13.1
N$23  (1 unrouted)
  Top 0.152: IC2.6 6.43,33.24 7.16,32.51 7.16,30.44 JMP15.1
  Top 0.305: R13.2 30.35,34.92 27.53,37.74 23.01,37.74 21.34,36.07 21.34,34.04 20.83,33.53 17.65,33.53 14.48,30.35 9.23,30.35 JMP15.2
N$26
  Top 0.305: R15.1 38.35,59.69 PAD6.1
N$27
  Top 0.305: JMP2.2 25,63.9 25.53,63.37 29.86,63.37 R15.2
N$30
  Top 0.305: R16.1 PAD8.1
N$31  (1 unrouted)
  Top 0.152: IC4.6 6.74,53.82 9.88,50.67 9.88,49.53 | 9.88,49.53 9.88,49.4 | 9.88,49.53 9.88,42.32 8.59,41.02 8.59,39.75 8.84,39.5 11.07,39.5 11.12,39.5 11.89,40.27 JMP_5.2 | JMP_5.1 12.71,38.27 12.79,38.19
  Top 0.305: R16.2 13.58,35.84 13.58,37.4 12.79,38.19 12.39,38.58 | IC4.6 6.19,53.82
N$33
  Top 0.305: JMP.1 66.82,72.26 S7.1 66.8,71.12 66.8,67.38 R11.1
N$34
  Top 0.305: JMP_.2 15.24,52.07 13.49,53.82 IC4.9
N$35
  Top 0.305: JMP1.2 13.97,73.41 12.98,74.39 IC3.9
N$36
  Top 0.305: IC3.6 3.78,74.39 3.3,73.91 3.3,70.23 6.35,67.18 JMP2.1
N$37
  Top 0.305: JMP3.1 73.9,75.83 69.22,80.52 4.45,80.52 2.67,78.74 2.67,77.34 3.02,76.99 IC3.2
N$39
  Top 0.305: JMP_1.2 34.54,62.75 34.54,57.02 31.24,53.72 24.26,53.72 21.34,56.64 21.34,57.66 20.7,58.29 16.38,58.29 13.86,55.77 IC4.12
REC/PB
  Top 0.152: 72.77,23.88 70.12,26.53 67.04,26.53 63.63,23.11 | 55.63,3.56 53.47,5.71 42.67,5.71 42.42,5.46 PAD32.1
  Top 0.305: 63.63,23.11 59.82,23.11 57.17,25.76 53.59,25.76 51.18,23.34 39.85,23.34 S5.1 21.77,22.81 20.45,24.13 R6.2 | 72.77,23.88 72.77,7.37 68.96,3.56 55.63,3.56
VCCIO  (4 unrouted)
  Top 0.152: 31.24,40.64 29.31,38.71 25.93,38.71 25.16,39.48 R7.2 24.53,39.75 14.73,39.75 12.95,41.53 11.1,41.53 10.16,40.59 JMP_3.2 | 7.62,15.95 5.47,15.95 | IC1.4 6.83,13.97 7.62,14.76 7.62,15.95 | IC1.11 11.24,13.89 10.16,13.89 9.88,14.17 | 8.38,33.02 8.31,33.1 8.31,23.8 8.28,23.8 | IC3.4 2.92,75.69 1.78,74.55 1.78,65.28 1.14,64.64 1.14,62.69 1.61,62.22 3.72,62.22 3.8,62.14 | R4.2 24.15,64.77 5.08,64.77 3.81,63.5 3.81,62.15 3.8,62.14 | R6.1 8.61,24.13 8.26,23.77 8.26,19.86 7.58,19.19 JMP_11.1 7.58,15.98 7.62,15.95 | 15.49,60.58 14.35,61.72 4.22,61.72 3.8,62.14 | IC4.8 10.16,52.01 JMP_3.2 | JMP_3.2 10.16,48.95 | IC2.13 12.44,35.84 12.93,35.36 12.93,34.54 12.68,34.29 11.32,34.29 | 9.88,14.17 9.88,12.34 10.21,12.02 IC1.8 | 9.88,14.17 9.88,15.52 10.28,15.92 IC1.14 | IC1.14 11.32,17.69 10.41,18.59 9.76,18.59 JMP_11.2 | 60.5,15.93 IC1.14
  Top 0.305: R11.2 51.1,65.58 48.77,63.25 44.58,63.25 44.21,63.61 44.21,64.24 | 44.21,64.24 R14.2 | R4.2 25.04,64.88 25.68,64.24 44.21,64.24 | PAD3.1 38.48,30.23 40.01,28.7 53.98,28.7 PAD5.1 58.17,32.26 59.44,33.53 59.44,39.62 60.07,40.26 | R2.2 62.98,15.9 60.48,15.9 | 60.48,15.9 59.05,14.48 59.05,7.49 58.67,7.11 PAD7.1 56.01,8.38 PAD22.1 | 60.48,15.9 60.5,15.93 | R12.2 44.2,40.64 | 44.2,40.64 31.24,40.64 | R9.2 60.07,40.26 | 60.07,40.26 51.69,40.26 50.67,39.24 44.7,39.24 44.2,39.75 44.2,40.64 | IC1.14 11.29,15.95 | IC1.1 5.47,15.95 | IC1.13 IC1.14 | IC1.10 IC1.11 | IC2.13 IC2.14 10.16,37.65 10.16,38.33 | IC2.10 11.32,34.29 IC2.11 8.76,34.54 8.38,34.92 | IC2.1 7.62,36.49 8.38,35.73 8.38,34.92 | IC2.8 8.81,32.59 8.38,33.02 8.38,34.92 | IC2.4 8,34.54 8.38,34.92 | IC4.1 8.38,57.07 | 8.38,57.07 IC4.14 | IC4.13 IC4.14 | IC4.10 IC4.11 9.02,55.12 8.38,55.75 | IC4.8 9.19,53.17 8.38,53.98 8.38,55.75 | 8.38,55.75 8.38,57.07 | IC4.4 7.75,55.12 8.38,55.75 | IC3.1 8.38,77.64 | 8.38,77.64 IC3.14 IC3.13 | IC3.10 IC3.11 8.89,75.69 8.38,76.2 | IC3.4 7.87,75.69 8.38,76.2 | 8.38,76.2 8.38,77.64 | IC3.8 8.68,73.74 8.38,74.04 8.38,76.2 | IC1.14 | 10.16,40.26 10.27,40.26 JMP_3.2 | IC4.14 13.89,57.07 15.49,58.67 15.49,60.58

### Text on the board
tPlace: RED | FREQ A | GREEN | B&W | BLUE | FREQ B | REC/PB | FREQ C | BÉCHAMEL | PREPARED / INSTRUMENTS | 2024